# Altium schematic sheet Bosch.SchDoc
size A4; SheetNumber: 1; SheetTotal: 2
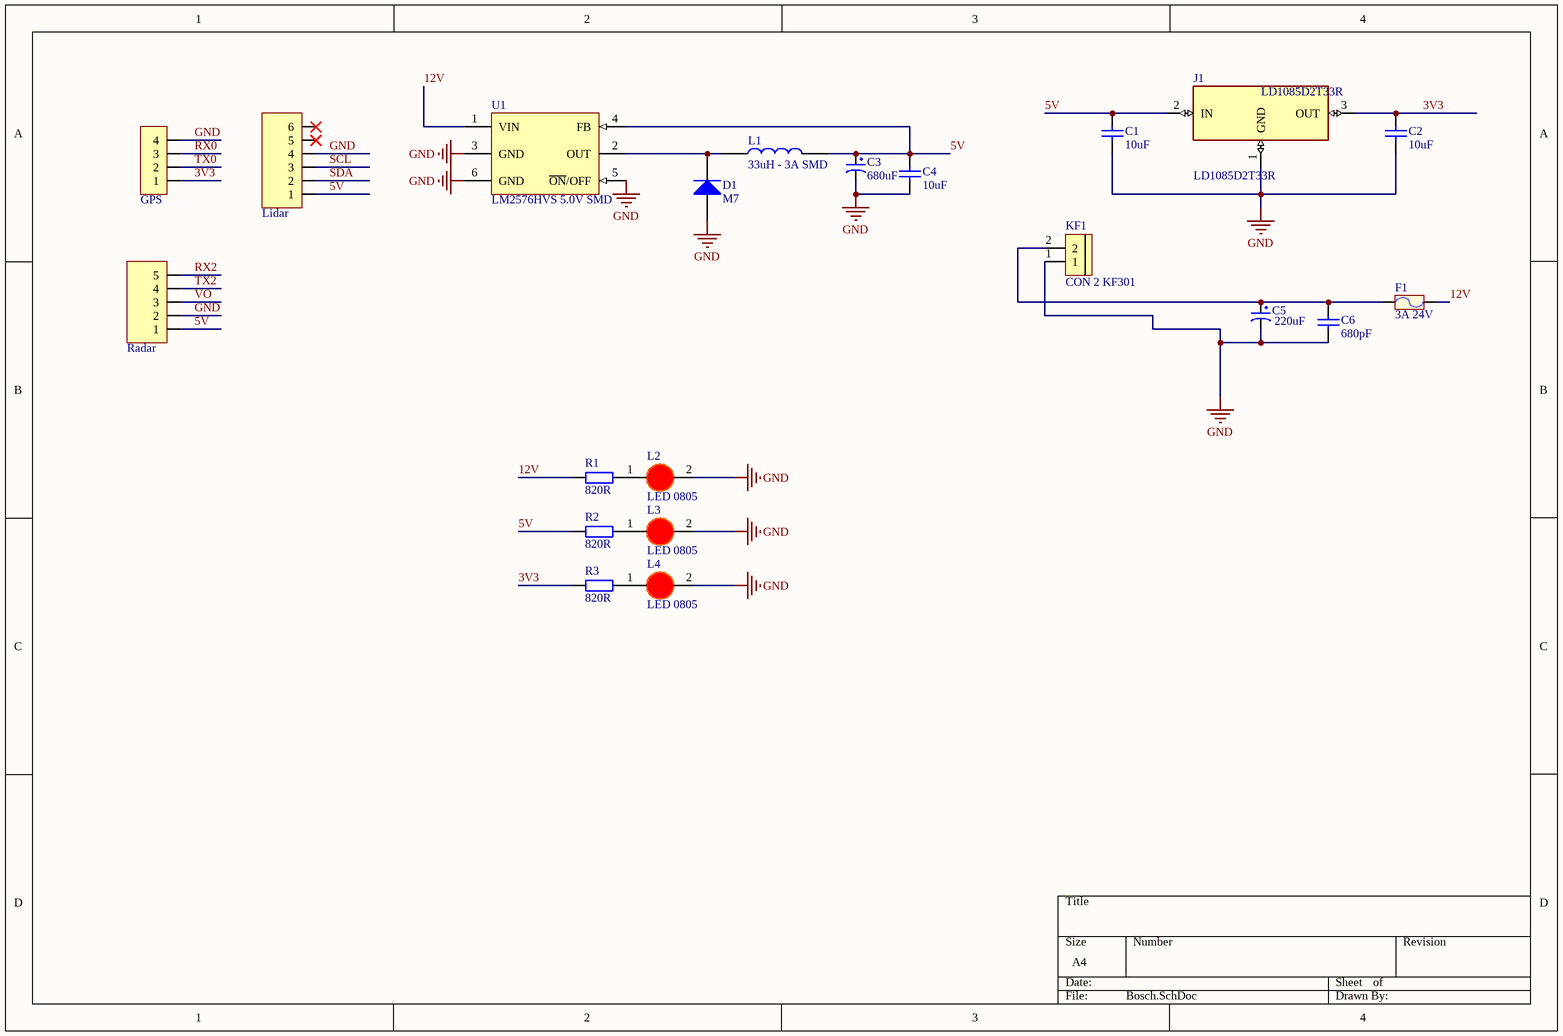
[diagram p0: Bosch.SchDoc]

## Parts
C1  10uF  [tu 0805]
C2  10uF  [tu 0805]
C3  680uF  [tu hoa 10mm]
C4  10uF  [tu 0805]
C5  220uF  [tu hoa 10mm]
C6  680pF  [tu 0805]
D1  M7  [DIODE SMA]
F1  3A 24V  [Cau chi tu phuc hoi 2A 24V SMD1812]
J1  LD1085D2T33R  [LD1085D2T33R]
JP1  Radar  [JP 1x5 CT]
JP2  Lidar  [JP 1x6 CT]
JP3  GPS  [JP 1x4 CT]
KF1  CON 2 KF301  [Con 2 KF301 5.08]
L1  33uH - 3A SMD  [Cuon Cam 12x12x10]
L2  LED 0805  [LED-0805-Red]
L3  LED 0805  [LED-0805-Red]
L4  LED 0805  [LED-0805-Red]
R1  820R  [Tro SMD 0805]
R2  820R  [Tro SMD 0805]
R3  820R  [Tro SMD 0805]
U1  LM2576HVS 5.0V SMD  [TO263-5]

## Nets
GND: C1.2 C2.2 C3.2 C4.2 C5.2 C6.2 D1.1(A) J1.1(GND) JP1.2 JP2.4 JP3.4 KF1.1 L2.2(K) L3.2(K) L4.2(K) U1.3(GND) U1.5(~{ON}/OFF) U1.6(GND)
3V3: C2.1 J1.3(OUT) JP3.1 R3.1
5V: C1.1 C3.1 C4.1 J1.2(IN) JP1.1 JP2.1 L1.2 R2.1 U1.4(FB)
12V: F1.2 R1.1 U1.1(VIN)
RX0: JP3.3
RX2: JP1.5
SCL: JP2.3
SDA: JP2.2
TX0: JP3.2
TX2: JP1.4
VO: JP1.3
NetC5_1: C5.1 C6.1 F1.1 KF1.2
NetD1_2: D1.2(K) L1.1 U1.2(OUT)
NetL2_1: L2.1(A) R1.2
NetL3_1: L3.1(A) R2.2
NetL4_1: L4.1(A) R3.2

Not connected (* = marked no-connect by the designer): JP2 5* 6*

## Library data of the parts
C1 C2 C4 C6 = Tu 0805 680pF 50V 10%: Dán; Don_Vi: Con; So_Chan: 2; Ten_Linh_Kien: Tụ 0805 680pF 50V 10%; Ma_Hang: MH008098; Chung_Loai: Dán; Kieu_Chan: *
C3 C5 = Tu Hoa 470uF 35V 10x15: Cắm; Don_Vi: Con; So_Chan: 2; Ten_Linh_Kien: Tụ Hóa 470uF 35V 10x15MM; Ma_Hang: MH002204; Chung_Loai: Cắm; Kieu_Chan: *
D1 = Diode M7 ( 4007 ): Dán; Don_Vi: Con; Ten_Linh_Kien: Diode M7 1N4007 SMD 1A 1000V; Ma_Hang: MH000944; Chung_Loai: Dán; Ghi_Chu: *
F1 = Cau chi tu phuc hoi 2A 24V SMD1812: 2A 24V SMD1812; Ma_Hang: MH010033; Ten: Cầu Chì Tự Phục Hồi 2A 24V SMD1812
J1 = LD1085D2T33R: Linear Voltage Regulator IC Positive Fixed 1 Output 3A D2PAK; MF: STMicroelectronics; SnapEDA_Link: https://www.snapeda.com/parts/LD1085D2T33R/STMicroelectronics/view-part/?ref=snap; Package: D2PAK STMicroelectronics; Value: *; MP: LD1085D2T33R; Check_prices: https://www.snapeda.com/parts/LD1085D2T33R/STMicroelectronics/view-part/?ref=eda
JP1 = JP 1x5 2.54 Cai Thang: Cắm; Ten_Linh_Kien: Jump Đơn Cái 2.54MM 1x20P Thẳng; Don_Vi: Con; Ma_Hang: MH004006; Ghi_Chu: *; Kieu_Chan: *; Chung_Loai: Cắm
JP2 = JP 1x6 2.54 Cai Thang: Cắm; Ten_Linh_Kien: Jump Đơn Cái 2.54MM 1x20P Thẳng; Don_Vi: Con; Ma_Hang: MH004006; Ghi_Chu: *; Kieu_Chan: *; Chung_Loai: Cắm
JP3 = JP 1x4 2.54 Cai Thang: Cắm; Ten_Linh_Kien: Jump Đơn Cái 2.54MM 1x20P Thẳng; Don_Vi: Con; Ma_Hang: MH004006; Ghi_Chu: *; Kieu_Chan: *; Chung_Loai: Cắm
KF1 = CON 2 KF301: Cắm; Ma_Hang: MH000987; Ten_Linh_Kien: CON 2 KF301-2P 5.08MM Xanh Dương; Chung_Loai: Cắm; Ghi_Chu: *; Kieu_Chan: *; Don_Vi: Con
L1 = CUON CAM 100uH SMD: Dán; Don_Vi: Con; Ma_Hang: MH003999; Ten_Linh_Kien: Cuộn Cảm 100uH 7x7x4MM CD74; Ma_Hang: *; Kieu_Chan: *; Chung_Loai: Dán
L2-L4 = LED 0805 Do: Dán; Don_Vi: Con; Ma_Hang: MH000897; Ten_Linh_Kien: LED 0805 Màu Đỏ (Red); Ghi_Chu: *; Kieu_Chan: *; Chung_Loai: Dán
R1-R3 = Tro 0805 5% 820R: Dán; Don_Vi: Con; So_Chan: 2; Ma_Hang: MH005346; Ten_Linh_Kien: Trở 0805 5% 820R; Chung_Loai: Dán; Kieu_Chan: *
U1 = LM2576HVS 5.0V SMD: Dán; Ten_Linh_Kien: LM2576HVS-5.0V BUCK 5V 3A TO263-5; Don_Vi: Con; Ma_Hang: MH002362; Ghi_Chu: *; Kieu_Chan: *; Chung_Loai: Dán